# Altium schematic sheet PAGE1-CONTENT.SchDoc
size A3; DocumentNumber: 1; SheetNumber: 1; SheetTotal: 2
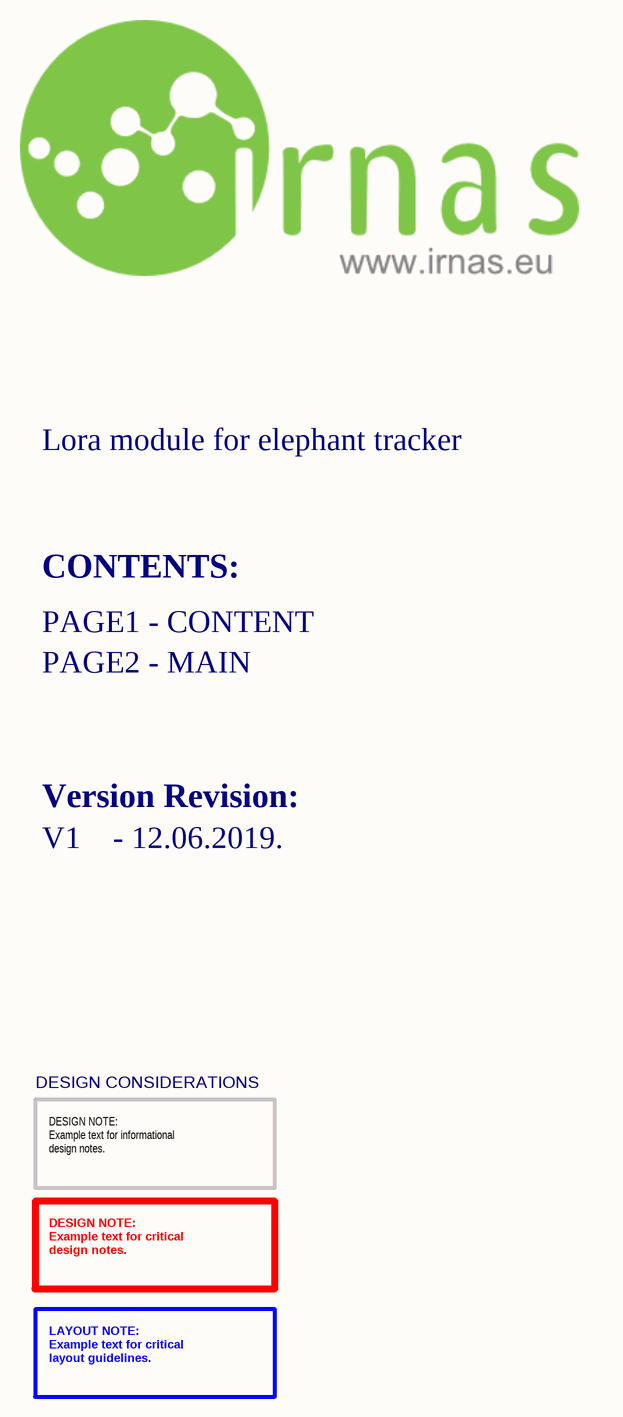
[diagram p0: PAGE1-CONTENT.SchDoc]

## Notes on the sheet
- Lora module for elephant tracker
- CONTENTS:
- PAGE1 - CONTENT
- PAGE2 - MAIN
- Version Revision:
- V1    - 12.06.2019.
- DESIGN CONSIDERATIONS
- DESIGN NOTE:
  Example text for informational
  design notes.
- DESIGN NOTE:
  Example text for critical
  design notes.
- LAYOUT NOTE:
  Example text for critical
  layout guidelines.
- Size: A3
- Revision:
- Sheet
- of